# Altium project F4x1_Dev_Project.PrjPcb
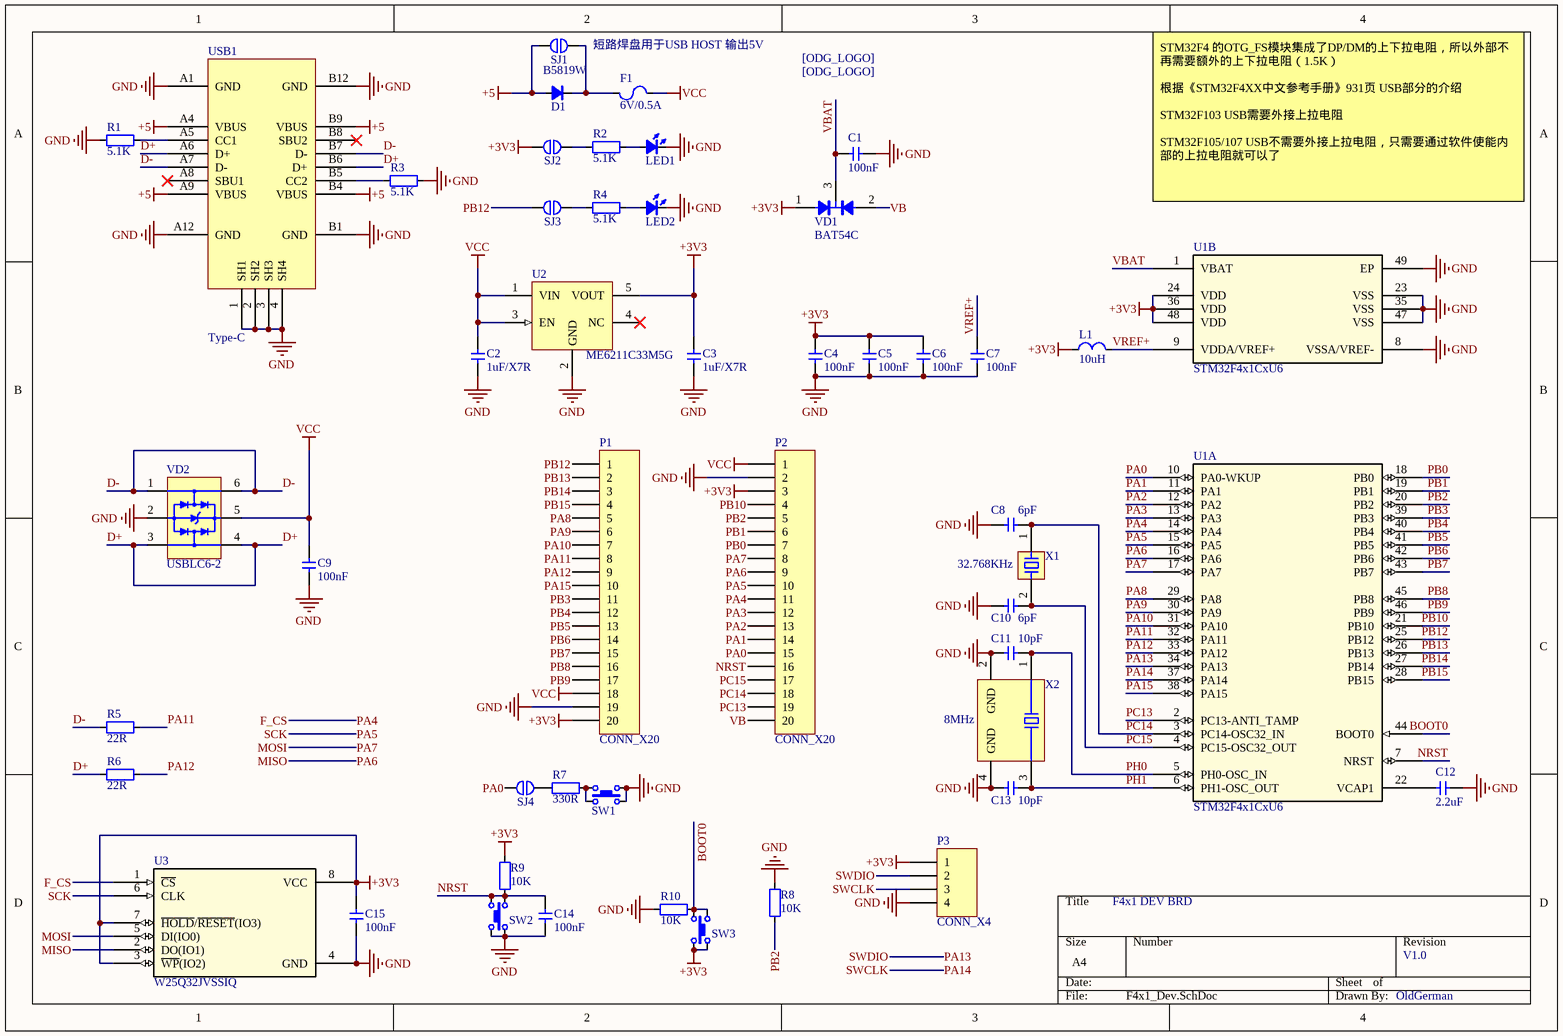
[diagram p0: F4x1_Dev.SchDoc]
1 sheet, 50 parts. Net scope: global (net labels, ports and power ports of the same name join across sheets).
Board file: F4x1_Dev.PcbDoc

## Sheet F4x1_Dev.SchDoc
size A4

### Parts
*1  ODG_LOGO  [ODG_LOGO]  (value not drawn)
*2  ODG_LOGO  [ODG_LOGO]  (value not drawn)
C1  100nF  [C0603]
C2  1uF/X7R  [C0603]
C3  1uF/X7R  [C0603]
C4  100nF  [C0603]
C5  100nF  [C0603]
C6  100nF  [C0603]
C7  100nF  [C0603]
C8  6pF  [C0603]
C9  100nF  [C0603]
C10  6pF  [C0603]
C11  10pF  [C0603]
C12  2.2uF  [C0603]
C13  10pF  [C0603]
C14  100nF  [C0603]
C15  100nF  [C0603]
D1  B5819W  [SOD-323]
F1  6V/0.5A  [FUSE0603_0.5MM]
L1  10uH  [FER0603]
LED1  LED  [LED0603_GREEN]  (value not drawn)
LED2  LED  [LED0603_YELLOW]  (value not drawn)
P1  CONN_X20  [2.54MM_MALE_X20]
P2  CONN_X20  [2.54MM_MALE_X20]
P3  CONN_X4  [2.54mm_Male_x4]
R1  5.1K  [R0603]
R2  5.1K  [R0603]
R3  5.1K  [R0603]
R4  5.1K  [R0603]
R5  22R  [R0603]
R6  22R  [R0603]
R7  330R  [R0603]
R8  10K  [R0603]
R9  10K  [R0603]
R10  10K  [R0603]
SJ1  SJ_2P  [SJ_2P]  (value not drawn)
SJ2  SJ_2P  [SJ_2P_MINI]  (value not drawn)
SJ3  SJ_2P  [SJ_2P_MINI]  (value not drawn)
SJ4  SJ_2P  [SJ_2P_MINI]  (value not drawn)
SW1  Button-4P  [SWITCH_3X4X2.5_4PIN_SMD]  (value not drawn)
SW2  Button-4P  [SWITCH_3X4X2.5_4PIN_SMD]  (value not drawn)
SW3  Button-4P  [SWITCH_3X4X2.5_4PIN_SMD]  (value not drawn)
U1  STM32F4x1CxU6  [UFQFPN-48_7X7X0P55MM_VIA]  (parts A,B of 2)
U2  ME6211C33M5G  [ANALOG TSOT-23-5 UJ-5]
U3  W25Q32JVSSIQ  [WIN_SS-8_WIN-L]
USB1  Type-C  [Type-C-TOP]
VD1  BAT54C  [ON SEMI SOT-23-3]
VD2  USBLC6-2  [MICROCHIP SOT-23-6 M6]
X1  32.768KHz  [XTAL_2P_3215]
X2  8MHz  [EPSON TSX-3225]

### Nets
+3V3: C3.2 C4.2 C5.1 C6.1 C15.2 L1.1 P1.20 P2.3 P3.1 R9.1 SJ2.1 SW3.3 SW3.4 U1.24(VDD) U1.36(VDD) U1.48(VDD) U2.5(VOUT) U3.3(~{WP}(IO2)) U3.7(~{HOLD}/~{RESET}(IO3)) U3.8(VCC) VD1.1
+5: D1.1(A) SJ1.1 USB1.A4(VBUS) USB1.A9(VBUS) USB1.B4(VBUS) USB1.B9(VBUS)
GND: C1.2 C2.1 C3.1 C4.1 C5.2 C6.2 C7.1 C8.2 C9.1 C10.2 C11.2 C12.1 C13.2 C14.1 C15.1 LED1.2(K) LED2.2(K) P1.19 P2.2 P3.4 R1.1 R3.2 R8.2 R10.2 SW1.3 SW1.4 SW2.1 SW2.2 U1.8(VSSA/VREF-) U1.23(VSS) U1.35(VSS) U1.47(VSS) U1.49(EP) U2.2(GND) U3.4(GND) USB1.1(SH1) USB1.2(SH2) USB1.3(SH3) USB1.4(SH4) USB1.A1(GND) USB1.A12(GND) USB1.B1(GND) USB1.B12(GND) VD2.2(GND) X2.2(GND) X2.4(GND)
VCC: C2.2 C9.2 F1.2 P1.18 P2.1 U2.1(VIN) U2.3(EN) VD2.5(VBUS)
BOOT0: R10.1 SW3.1 SW3.2 U1.44(BOOT0)
D+: R6.1 USB1.A6(D+) USB1.B6(D+) VD2.3(I/O2) VD2.4(I/O2)
D-: R5.1 USB1.A7(D-) USB1.B7(D-) VD2.1(I/O1) VD2.6(I/O1)
F_CS: P2.11 U1.14(PA4) U3.1(~{CS})  [also labelled PA4]
MISO: P2.9 U1.16(PA6) U3.2(DO(IO1))  [also labelled PA6]
MOSI: P2.8 U1.17(PA7) U3.5(DI(IO0))  [also labelled PA7]
NRST: C14.2 P2.16 R9.2 SW2.3 SW2.4 U1.7(NRST)
PA0: P2.15 SJ4.1 U1.10(PA0-WKUP)
PA1: P2.14 U1.11(PA1)
PA2: P2.13 U1.12(PA2)
PA3: P2.12 U1.13(PA3)
PA5: P2.10 U1.15(PA5) U3.6(CLK)  [also labelled SCK]
PA8: P1.5 U1.29(PA8)
PA9: P1.6 U1.30(PA9)
PA10: P1.7 U1.31(PA10)
PA11: P1.8 R5.2 U1.32(PA11)
PA12: P1.9 R6.2 U1.33(PA12)
PA13: P3.2 U1.34(PA13)  [also labelled SWDIO]
PA14: P3.3 U1.37(PA14)  [also labelled SWCLK]
PA15: P1.10 U1.38(PA15)
PB0: P2.7 U1.18(PB0)
PB1: P2.6 U1.19(PB1)
PB2: P2.5 R8.1 U1.20(PB2)
PB3: P1.11 U1.39(PB3)
PB4: P1.12 U1.40(PB4)
PB5: P1.13 U1.41(PB5)
PB6: P1.14 U1.42(PB6)
PB7: P1.15 U1.43(PB7)
PB8: P1.16 U1.45(PB8)
PB9: P1.17 U1.46(PB9)
PB10: P2.4 U1.21(PB10)
PB12: P1.1 SJ3.1 U1.25(PB12)
PB13: P1.2 U1.26(PB13)
PB14: P1.3 U1.27(PB14)
PB15: P1.4 U1.28(PB15)
PC13: P2.19 U1.2(PC13-ANTI_TAMP)
PC14: C8.1 P2.18 U1.3(PC14-OSC32_IN) X1.1
PC15: C10.1 P2.17 U1.4(PC15-OSC32_OUT) X1.2
PH0: C11.1 U1.5(PH0-OSC_IN) X2.1
PH1: C13.1 U1.6(PH1-OSC_OUT) X2.3
VB: P2.20 VD1.2
VBAT: C1.1 U1.1(VBAT) VD1.3
VREF+: C7.2 L1.2 U1.9(VDDA/VREF+)
NetC12_2: C12.2 U1.22(VCAP1)
NetD1_2: D1.2(C) F1.1 SJ1.2
NetLED1_1: LED1.1(A) R2.2
NetLED2_1: LED2.1(A) R4.2
NetR1_2: R1.2 USB1.A5(CC1)
NetR2_1: R2.1 SJ2.2
NetR3_1: R3.1 USB1.B5(CC2)
NetR4_1: R4.1 SJ3.2
NetR7_1: R7.1 SW1.1 SW1.2
NetR7_2: R7.2 SJ4.2

Not connected (* = marked no-connect by the designer): U2 4(NC)*; USB1 A8(SBU1)* B8(SBU2)*

### Notes on the sheet
- 短路焊盘用于USB HOST 输出5V
- STM32F4 的OTG_FS模块集成了DP/DM的上下拉电阻，所以外部不再需要额外的上下拉电阻（1.5K）
  根据《STM32F4XX中文参考手册》931页 USB部分的介绍
  STM32F103 USB需要外接上拉电阻
  STM32F105/107 USB不需要外接上拉电阻，只需要通过软件使能内部的上拉电阻就可以了
- F4x1 DEV BRD
- V1.0
- OldGerman
- (in symbol ODG_LOGO) [ODG_LOGO]

### Library data of the parts
C1-C15 = CAP: Capacitor; Value: 0.1u
D1 = DIODE: 二极管
F1 = FUSE: 贴片自恢复保险丝
L1 = inductor_mini: 贴片叠层电感
LED1 LED2 = LED: Value: color?
R1-R4 R7-R10 = RES: Resistor; Value: 22R
R5 R6 = RES: Resistor; Value: 22R
SJ1-SJ4 = SJ_2P: 焊接跳线
SW1-SW3 = Button-4P: Button
U1 = STM32F411CEU7: No Description Available; Mfr_Name: STMicroelectronics; Copyright: Copyright (C) 2022 Ultra Librarian. All rights reserved.; Manufacturer_Part_Number: STM32F411CEU7; RefDes: RefDes; Type: DEV
U2 = ME6211C33M5G: 线性稳压芯片; BOM名称: 可调升压芯片; 版权归属: 源创客; 学习资源: www.ooocke.com
U3 = W25Qxx: No Description Available; Mfr_Name: Winbond; Manufacturer_Part_Number: W25Q16DVSSIG; Copyright: Copyright (C) 2022 Ultra Librarian. All rights reserved.; RefDes: RefDes; Type: DEV
USB1 = USB-Type-C_16P
VD1 = BAT54C: 贴片肖特基二极管; BOM名称: 肖特基二极管; 版权归属: 源创客; 属性: 30V/0.2A; 学习资源: www.ooocke.com
VD2 = USBLC6-2: Very low capacitance ESD protection / Features / • 2 data-line protection / • Protects VBUS / • Very low capacitance: 3.5 pF max. / • Very low leakage current: 150 nA max. / • SOT-666 and SOT23-6L packages / • RoHS compliant; BOM名称: 钳位IC; 版权归属: 源创客; 属性: 30V/0.2A; 学习资源: www.ooocke.com
X1 = XTAL-2P: 2脚无源石英晶振; BOM名称: 4脚无源晶振; 版权归属: 源创客; 学习资源: www.ooocke.com
X2 = XTAL-4P: 4脚无源石英晶振; BOM名称: 4脚无源晶振; 版权归属: 源创客; 学习资源: www.ooocke.com